# Altium project MiCom.PrjPcb (part 4 of 6)

## Sheet MMC.SchDoc
size A2
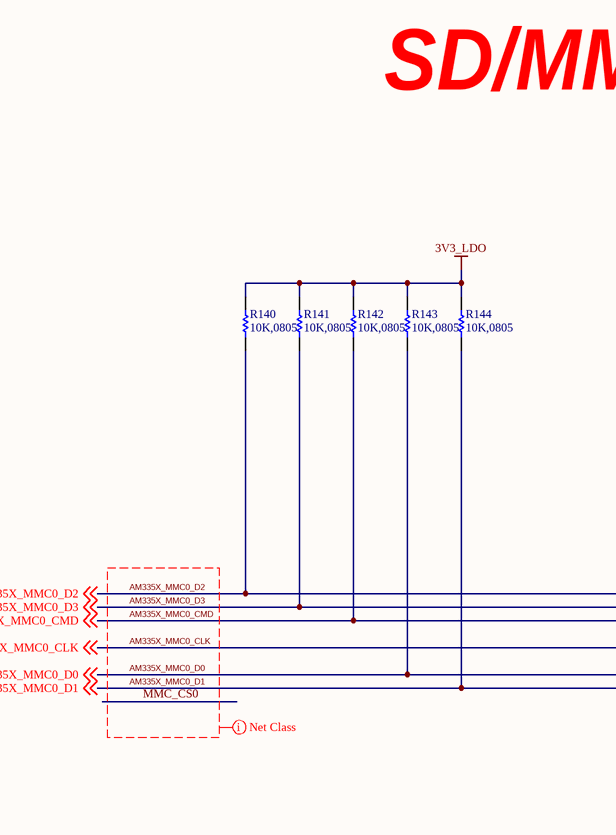
[diagram p14: MMC.SchDoc, left]
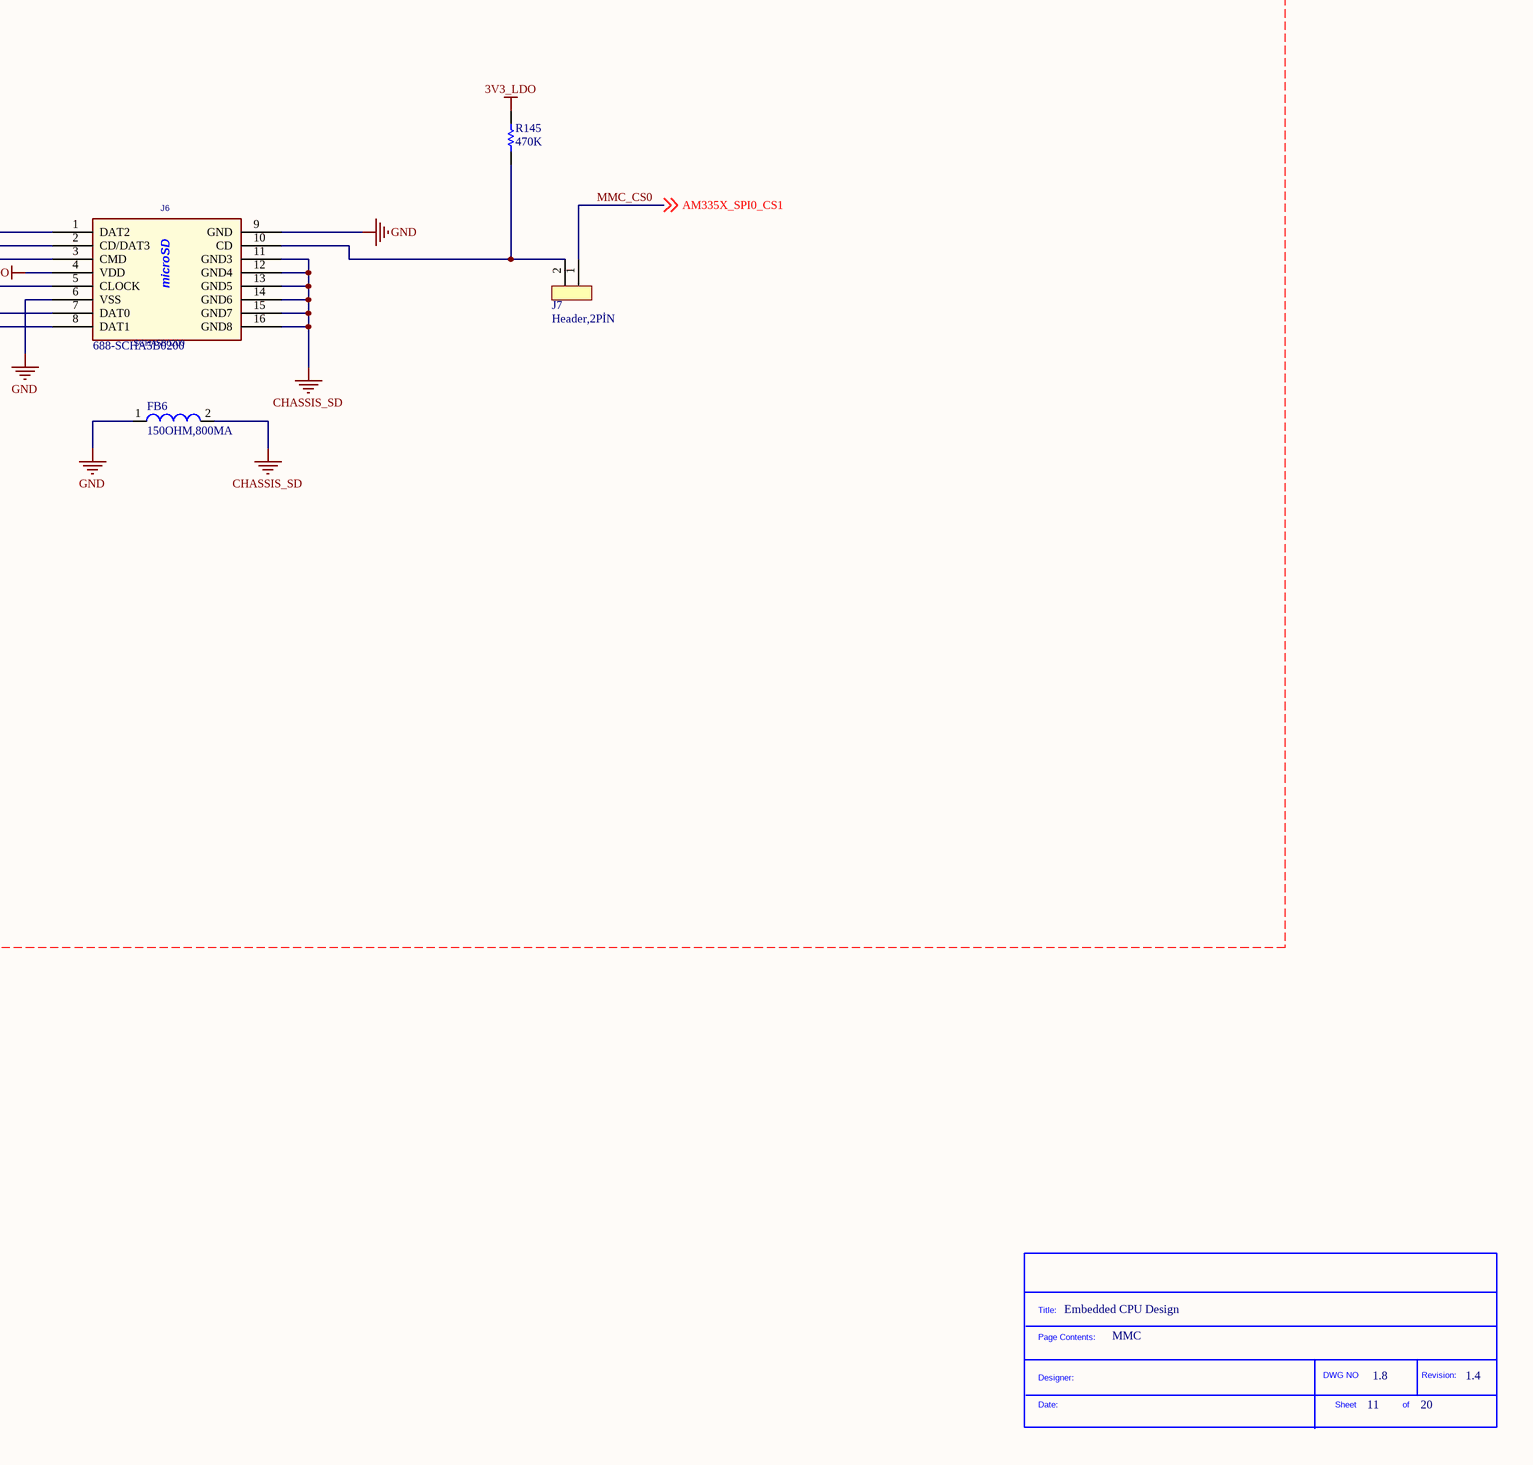
[diagram p15: MMC.SchDoc, right]

### Parts
(Parts that share a designator on the sheet are numbered #1, #2 ... from top to bottom, then left to right.)
*?#8  SDTitleBlock  (value not drawn)  (graphical)
FB6  150OHM,800MA  [0805]
J6  SCHA5B0200  Supplier Part Number 1: 688-SCHA5B0200  [SD-MICRO-SCHA5B0300]
J7  Header,2PİN  [HEADER,2PİN]
R140  10K,0805  [0805]
R141  10K,0805  [0805]
R142  10K,0805  [0805]
R143  10K,0805  [0805]
R144  10K,0805  [0805]
R145  470K  [0805]

### Nets
3V3_LDO: J6.4(VDD) R140.2 R141.2 R142.2 R143.2 R144.2 R145.2
CHASSIS_SD: FB6.2 J6.11(GND3) J6.12(GND4) J6.13(GND5) J6.14(GND6) J6.15(GND7) J6.16(GND8)
GND: FB6.1 J6.6(VSS) J6.9(GND)
AM335X_MMC0_CLK: J6.5(CLOCK) ; off-sheet AM335X_MMC0_CLK
AM335X_MMC0_CMD: J6.3(CMD) R142.1 ; off-sheet AM335X_MMC0_CMD
AM335X_MMC0_D0: J6.7(DAT0) R143.1 ; off-sheet AM335X_MMC0_D0
AM335X_MMC0_D1: J6.8(DAT1) R144.1 ; off-sheet AM335X_MMC0_D1
AM335X_MMC0_D2: J6.1(DAT2) R140.1 ; off-sheet AM335X_MMC0_D2
AM335X_MMC0_D3: J6.2(CD/DAT3) R141.1 ; off-sheet AM335X_MMC0_D3
MMC_CS0: J7.1 ; off-sheet AM335X_SPI0_CS1  [also labelled AM335X_SPI0_CS1]
NetJ6_10: J6.10(CD) J7.2 R145.1

### Layout directives
net class MMC: AM335X_MMC0_CLK, AM335X_MMC0_CMD, AM335X_MMC0_D0, AM335X_MMC0_D1, AM335X_MMC0_D2, AM335X_MMC0_D3, MMC_CS0
net class MMC_P: 3V3_LDO, AM335X_MMC0_CLK, AM335X_MMC0_CMD, AM335X_MMC0_D0, AM335X_MMC0_D1, AM335X_MMC0_D2, AM335X_MMC0_D3, AM335X_SPI0_CS1, CHASSIS_SD, GND, MMC_CS0

### Notes on the sheet
- SD/MMC Connector
- Embedded CPU Design
- MMC
- 11
- 1.8
- 20
- 1.4
- (in symbol SDTitleBlock) Title:; Page Contents:; DWG NO; Revision:; Designer:; Date:; Sheet; of

### Library data of the parts
FB6 = 150OHM,800MA: FERRITE 800MA 150 OHM 0805 SMD; Manufacturer: Laird-Signal Integrity Products; Manufacturer Part Number: LI0805H151R-10; Impedance @ Frequency: 150 Ohm @ 100MHz; DC Resistance (DCR): 150 mOhm Max; Filter Type: Differential Mode - Single; Supplier 1: Digi-Key; RoHS: RoHS Compliant; Category: Filters; Stock 1: 418596; Pricing 1: 1=0.1, 10=0.07, 25=0.064, 50=0.0574, 100=0.0421, 250=0.03064, 500=0.02808, 1000=0.02424 (USD); Packaging: Cut Tape (CT); Current Rating: 800mA; Package / Case: 0805 (2012 Metric); Mounting Type: Surface Mount; Height (Max): 0.043" (1.10mm); Size / Dimension: 0.079" L x 0.049" W (2.00mm x 1.25mm); ComponentLink1URL: http://www.lairdtech.com/WorkArea/linkit.aspx?LinkIdentifier=id&ItemID=4912; ComponentLink1Description: http://www.lairdtech.com/WorkArea/linkit.aspx?LinkIdentifier=id&ItemID=4912; Supplier Part Number 1: 240-2384-1-ND
J6 = Conn_microSD_8: TIIntPartnumber: 2C0102; Mfr: ALPS; PartName: Conn_microSD_SCHA5B0200; DescriptiveText: Connector compact low-profile Push Type Micro SD; Cost10K: x.00; Vendor: Mouser; Number of Contacts: 8; Voltage Rating: 500 VAC; Insertion - Extraction Style: Push-Push; Mating Cycles: 10 k; Cost100: x.00; MfrNum: SCHA5B0200; Supplier 1: Mouser; Manufacturer: ALPS; Manufacturer Part Number: SCHA5B0200; RoHS: RoHS Compliant; Category: Memory Card Connectors; Features: With switch; Height: 15.25 mm; Length: 13.825 mm; Mounting Type: Reverse; Number of Rows: 1; Orientation: Horizontal; Packaging: Reel; Product: Card Connectors; Termination Style: SMD; Brand: ALPS; Mounting Style: -; Card Type: microSD; Standard Pack Qty: 1500; RoHS - Mouser: Y; Minimum Order Quantity: 1; Reeling: True; ComponentLink1URL: http://www.mouser.com/ds/2/15/SCHA-186221.pdf; ComponentLink1Description: http://www.mouser.com/ds/2/15/SCHA-186221.pdf; Stock 1: 13412; Pricing 1: 1=1.62, 25=1.46, 50=1.35, 100=1.31, 500=1.22, 1000=1.18, 1500=1.14, 4500=1.07, 9000=1.04 (AUD)
R140-R144 = 10K,0805: BOURNS - CR0805-FX-1002GLF - RESISTOR, 10K, 0.125W, 1%; Product Range: BOURNS - CR Series; Resistance: 10; Power Rating: 125; Resistor Case Style: 0805 [2012 Metric]; Resistor Element Material: Thick Film; Temperature Coefficient: ± 100; Voltage Rating: 150; SVHC: No SVHC (16-Jun-2014); Resistor Mounting: SMD<!--FANDB--><div class="features-and-benefits-container"></div>; Power (Watts): 0.125W, 1/8W; Supplier 1: Digi-Key; Manufacturer: BOURNS; Manufacturer Part Number: CR0805-FX-1002GLF; RoHS: YES; Stock 1: 1116166; Pricing 1: 1=0.1, 10=0.029, 50=0.0162, 100=0.0123, 250=0.00912, 500=0.00672, 1000=0.00448, 2500=0.00378 (USD); Resistance Tolerance: ± 1%; Packaging: Cut Tape; MSL: MSL 1 - Unlimited; ComponentLink1URL: http://www.farnell.com/datasheets/1845293.pdf; ComponentLink1Description: http://www.farnell.com/datasheets/1845293.pdf; Supplier Part Number 1: RMCF0805FT10K0CT-ND; Category: Resistors; Resistance (Ohms): 10k; Tolerance: ±1%; Composition: Thick Film; Features: -; Operating Temperature: -55°C ~ 155°C; Package / Case: 0805 (2012 Metric); Supplier Device Package: 0805; Size / Dimension: 0.079" L x 0.049" W (2.00mm x 1.25mm); Height: 0.026" (0.65mm); Number of Terminations: 2; ComponentLink2URL: http://www.seielect.com/Catalog/SEI-RMCF_RMCP.pdf; ComponentLink2Description: http://www.seielect.com/Catalog/SEI-RMCF_RMCP.pdf
R145 = 470K: RES 470K OHM 1/8W 1% 0805 SMD; Manufacturer: Rohm Semiconductor; Manufacturer Part Number: MCR10ERTF4703; Power (Watts): 0.125W, 1/8W; Temperature Coefficient: ±100ppm/°C; Supplier 1: Digi-Key; RoHS: RoHS Compliant; Category: Resistors; Stock 1: 10000; Pricing 1: 5000=0.00319, 10000=0.00277, 25000=0.00244, 50000=0.00223, 125000=0.00219 (USD); Packaging: Tape & Reel (TR); Resistance (Ohms): 470k; Tolerance: ±1%; Composition: Thick Film; Features: -; Package / Case: 0805 (2012 Metric); Supplier Device Package: 0805 (2012 Metric); Size / Dimension: 0.079" L x 0.049" W (2.00mm x 1.25mm); Height: 0.024" (0.60mm); Number of Terminations: 2; ComponentLink1URL: http://rohmfs.rohm.com/en/products/databook/datasheet/passive/resistor/chip_resistor/mcr_g.pdf; ComponentLink1Description: http://rohmfs.rohm.com/en/products/databook/datasheet/passive/resistor/chip_resistor/mcr_g.pdf; Supplier Part Number 1: RHM470KCHTR-ND

## Sheet NAND_MEMORY.SchDoc
size A2
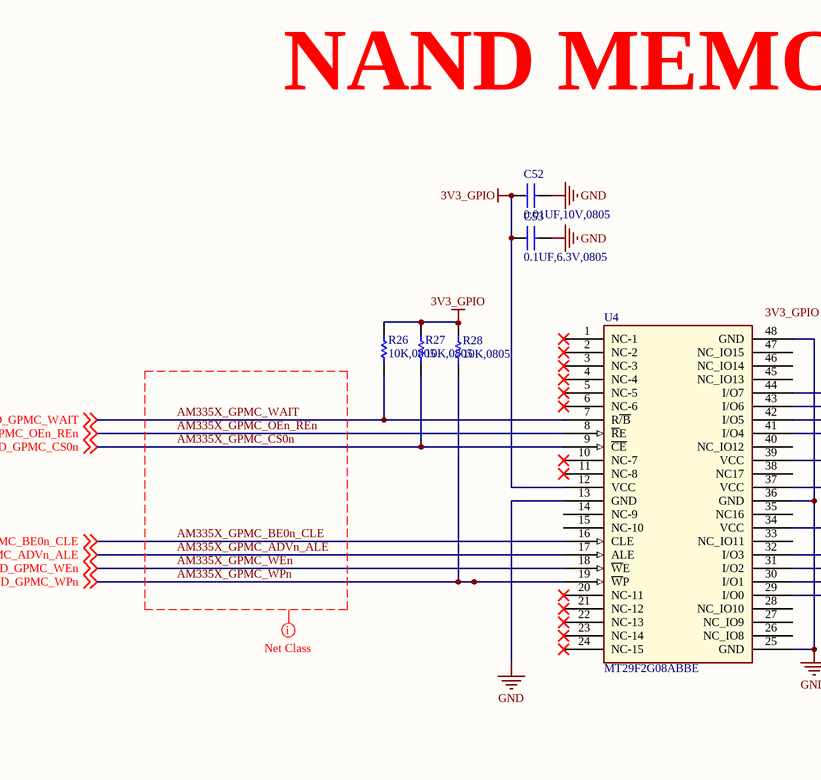
[diagram p16: NAND_MEMORY.SchDoc, left]
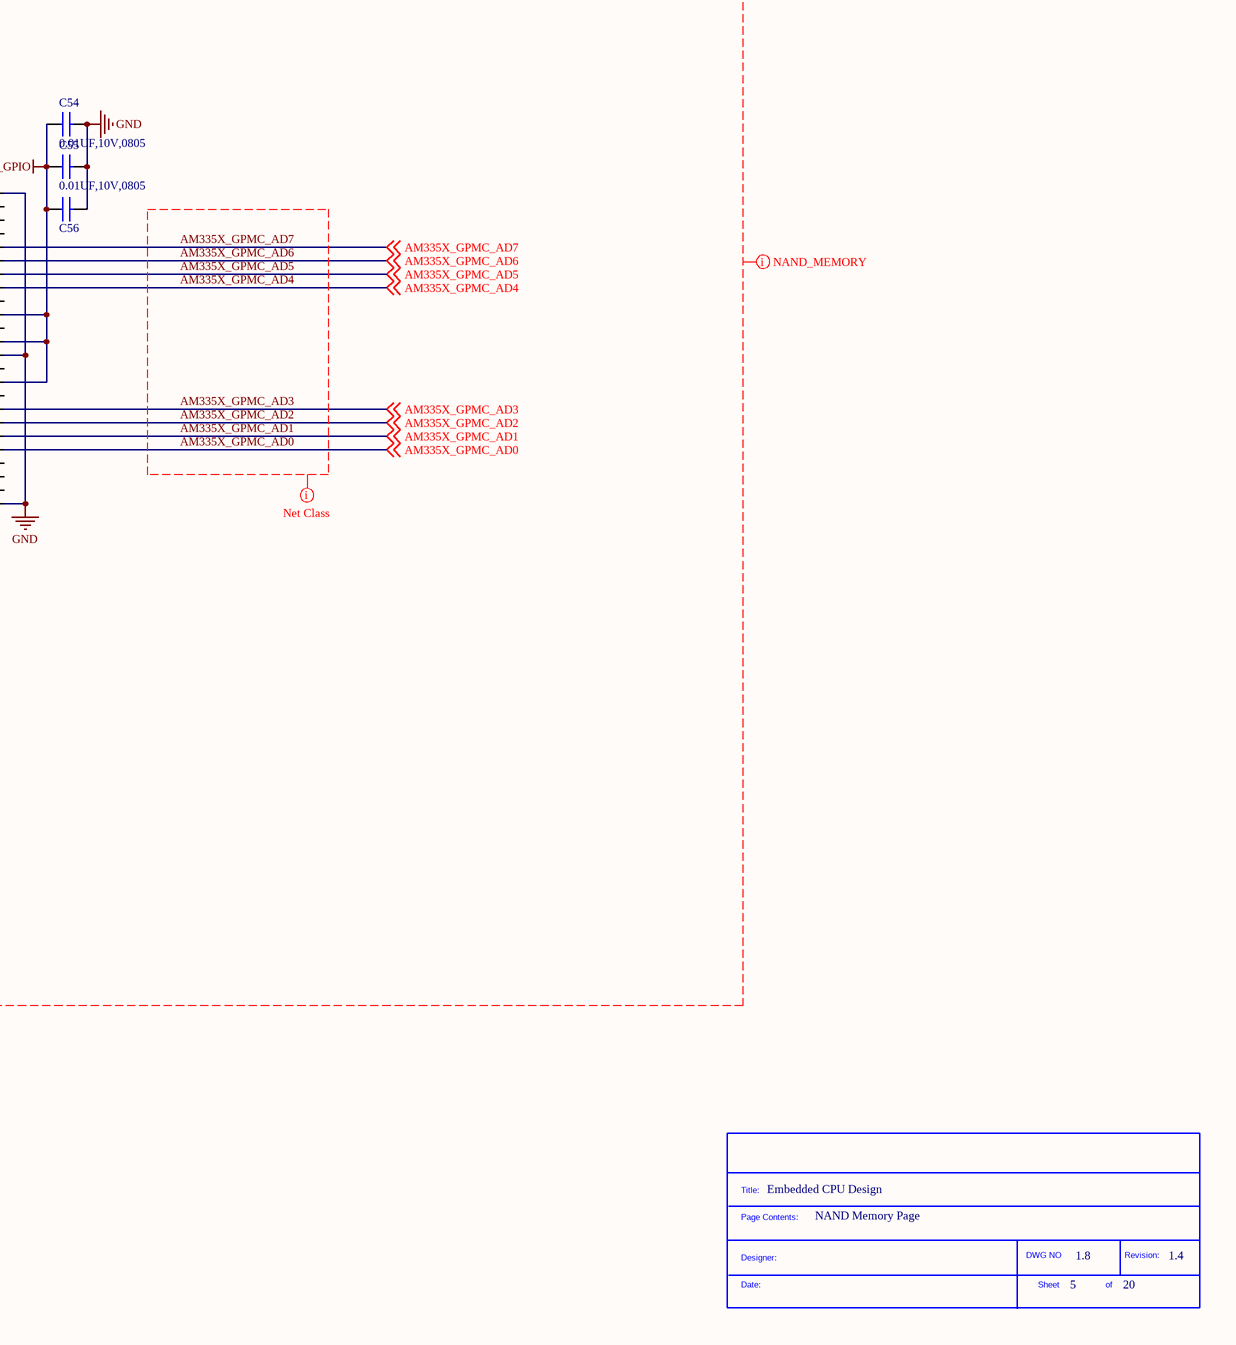
[diagram p17: NAND_MEMORY.SchDoc, right]

### Parts
(Parts that share a designator on the sheet are numbered #1, #2 ... from top to bottom, then left to right.)
*?#9  SDTitleBlock  (value not drawn)  (graphical)
C52  0.01UF,10V,0805  [0402]
C53  0.1UF,6.3V,0805  [0402]
C54  0.01UF,10V,0805  [0402]
C55  0.01UF,10V,0805  [0402]
C56  0.01UF,10V,0805  [0402]  (value not drawn)
R26  10K,0805  [0402]
R27  10K,0805  [0402]
R28  10K,0805  [0402]
U4  MT29F2G08ABBE  [skt-tsop48sm]

### Nets
3V3_GPIO: C52.1 C53.1 C54.1 C55.1 C56.1 R26.2 R27.2 R28.2 U4.12(VCC) U4.34(VCC) U4.37(VCC) U4.39(VCC)  [project net AM335X_VDDSHV1]
GND: C52.2 C53.2 C54.2 C55.2 C56.2 U4.13(GND) U4.25(GND) U4.36(GND) U4.48(GND)
AM335X_GPMC_AD0: U4.29(I/O0) ; off-sheet AM335X_GPMC_AD0
AM335X_GPMC_AD1: U4.30(I/O1) ; off-sheet AM335X_GPMC_AD1
AM335X_GPMC_AD2: U4.31(I/O2) ; off-sheet AM335X_GPMC_AD2
AM335X_GPMC_AD3: U4.32(I/O3) ; off-sheet AM335X_GPMC_AD3
AM335X_GPMC_AD4: U4.41(I/O4) ; off-sheet AM335X_GPMC_AD4
AM335X_GPMC_AD5: U4.42(I/O5) ; off-sheet AM335X_GPMC_AD5
AM335X_GPMC_AD6: U4.43(I/O6) ; off-sheet AM335X_GPMC_AD6
AM335X_GPMC_AD7: U4.44(I/O7) ; off-sheet AM335X_GPMC_AD7
AM335X_GPMC_ADVn_ALE: U4.17(ALE) ; off-sheet NAND_GPMC_ADVn_ALE  [also labelled NAND_GPMC_ADVn_ALE]
AM335X_GPMC_BE0n_CLE: U4.16(CLE) ; off-sheet NAND_GPMC_BE0n_CLE  [also labelled NAND_GPMC_BE0n_CLE]
AM335X_GPMC_CS0n: R27.1 U4.9(~{CE}) ; off-sheet NAND_GPMC_CS0n  [also labelled NAND_GPMC_CS0n]
AM335X_GPMC_OEn_REn: U4.8(~{R}E) ; off-sheet NAND_GPMC_OEn_REn  [also labelled NAND_GPMC_OEn_REn]
AM335X_GPMC_WAIT: R26.1 U4.7(R~{/B}) ; off-sheet NAND_GPMC_WAIT  [also labelled NAND_GPMC_WAIT]
AM335X_GPMC_WEn: U4.18(~{W}E) ; off-sheet NAND_GPMC_WEn  [also labelled NAND_GPMC_WEn]
AM335X_GPMC_WPn: R28.1 U4.19(~{W}P) ; off-sheet NAND_GPMC_WPn  [also labelled NAND_GPMC_WPn]

Not connected (* = marked no-connect by the designer): U4 1(NC-1)* 2(NC-2)* 3(NC-3)* 4(NC-4)* 5(NC-5)* 6(NC-6)* 10(NC-7)* 11(NC-8)* 14(NC-9) 15(NC-10) 20(NC-11)* 21(NC-12)* 22(NC-13)* 23(NC-14)* 24(NC-15)* 26(NC_IO8) 27(NC_IO9) 28(NC_IO10) 33(NC_IO11) 35(NC16) 38(NC17) 40(NC_IO12) 45(NC_IO13) 46(NC_IO14) 47(NC_IO15)

### Layout directives
net class NAND: AM335X_GPMC_ADVn_ALE, AM335X_GPMC_BE0n_CLE, AM335X_GPMC_CS0n, AM335X_GPMC_OEn_REn, AM335X_GPMC_WAIT, AM335X_GPMC_WEn, AM335X_GPMC_WPn
net class NAND_GPMC: AM335X_GPMC_AD0, AM335X_GPMC_AD1, AM335X_GPMC_AD2, AM335X_GPMC_AD3, AM335X_GPMC_AD4, AM335X_GPMC_AD5, AM335X_GPMC_AD6, AM335X_GPMC_AD7
net class NAND_MEMORY: 3V3_GPIO, AM335X_GPMC_AD0, AM335X_GPMC_AD1, AM335X_GPMC_AD2, AM335X_GPMC_AD3, AM335X_GPMC_AD4, AM335X_GPMC_AD5, AM335X_GPMC_AD6, AM335X_GPMC_AD7, AM335X_GPMC_ADVn_ALE, AM335X_GPMC_BE0n_CLE, AM335X_GPMC_CS0n, AM335X_GPMC_OEn_REn, AM335X_GPMC_WAIT, AM335X_GPMC_WEn, AM335X_GPMC_WPn, GND, NAND_GPMC_ADVn_ALE, NAND_GPMC_BE0n_CLE, NAND_GPMC_CS0n, NAND_GPMC_OEn_REn, NAND_GPMC_WAIT, NAND_GPMC_WEn, NAND_GPMC_WPn

### Notes on the sheet
- NAND MEMORY
- Embedded CPU Design
- NAND Memory Page
- 5
- 1.8
- 20
- 1.4
- (in symbol SDTitleBlock) Title:; Page Contents:; Designer:; DWG NO; Revision:; Date:; Sheet; of

### Library data of the parts
C52 C54-C56 = 0.01UF,10V,0805: MULTICOMP - MCSH21B103K100CT - CAP, MLCC, X7R, 10NF, 10V, 0805; Capacitance: 10000pF; Tolerance: ±10%; Voltage - Rated: 16V; Supplier 1: Digi-Key; Manufacturer: MULTICOMP; Manufacturer Part Number: MCSH21B103K100CT; RoHS: YES; Stock 1: 21284; Pricing 1: 1=0.24, 10=0.2, 50=0.1126, 100=0.1, 250=0.075, 500=0.06626, 1000=0.05875 (USD); ComponentLink1URL: http://www.farnell.com/datasheets/1825494.pdf; ComponentLink1Description: http://www.farnell.com/datasheets/1825494.pdf; Supplier Part Number 1: 399-7995-1-ND; Category: Capacitors; Packaging: Cut Tape (CT); Temperature Coefficient: X7R; Mounting Type: Surface Mount, MLCC; Operating Temperature: -55°C ~ 125°C; Applications: General Purpose; Ratings: -; Package / Case: 0805 (2012 Metric); Size / Dimension: 0.079" L x 0.049" W (2.00mm x 1.25mm); Height - Seated (Max): -; Thickness (Max): 0.035" (0.88mm); Lead Spacing: -; Features: -; Lead Style: -; ComponentLink2URL: http://www.kemet.com/docfinder?Partnumber=C0805C103K4RACTU; ComponentLink2Description: http://www.kemet.com/docfinder?Partnumber=C0805C103K4RACTU
C53 = 0.1UF,6.3V,0805: as C44-C46 on sheet DDR_3; Supplier 1: Digi-Key; RoHS: RoHS Compliant; Category: Capacitors; Stock 1: 19204; Pricing 1: 1=0.12, 10=0.083, 25=0.062, 50=0.0476, 100=0.0392, 250=0.03304, 1000=0.02228 (USD); Packaging: Digi-Reel®; Tolerance: ±10%; Voltage - Rated: 6.3V; Temperature Coefficient: X7R; Mounting Type: Surface Mount, MLCC; Operating Temperature: -55°C ~ 125°C; Applications: General Purpose; Ratings: -; Package / Case: 0805 (2012 Metric); Size / Dimension: 0.079" L x 0.049" W (2.00mm x 1.25mm); Height - Seated (Max): -; Thickness (Max): 0.035" (0.88mm); Lead Spacing: -; Features: -; Lead Style: -; ComponentLink1URL: http://www.kemet.com/docfinder?Partnumber=C0805C104K9RACTU; ComponentLink1Description: http://www.kemet.com/docfinder?Partnumber=C0805C104K9RACTU; Supplier Part Number 1: 399-9155-6-ND
R26-R28 = 10K,0805: as R140 on sheet MMC; Supplier 1: Digi-Key; Manufacturer: BOURNS; Manufacturer Part Number: CR0805-FX-1002GLF; RoHS: YES; Stock 1: 1116166; Pricing 1: 1=0.1, 10=0.029, 50=0.0162, 100=0.0123, 250=0.00912, 500=0.00672, 1000=0.00448, 2500=0.00378 (USD); Resistance Tolerance: ± 1%; Packaging: Cut Tape; MSL: MSL 1 - Unlimited; ComponentLink1URL: http://www.farnell.com/datasheets/1845293.pdf; ComponentLink1Description: http://www.farnell.com/datasheets/1845293.pdf; Supplier Part Number 1: RMCF0805FT10K0CT-ND; Category: Resistors; Resistance (Ohms): 10k; Tolerance: ±1%; Composition: Thick Film; Features: -; Operating Temperature: -55°C ~ 155°C; Package / Case: 0805 (2012 Metric); Supplier Device Package: 0805; Size / Dimension: 0.079" L x 0.049" W (2.00mm x 1.25mm); Height: 0.026" (0.65mm); Number of Terminations: 2; ComponentLink2URL: http://www.seielect.com/Catalog/SEI-RMCF_RMCP.pdf; ComponentLink2Description: http://www.seielect.com/Catalog/SEI-RMCF_RMCP.pdf
U4 = MT29F2G08ABBE: NAND 2Gb Flash Memory x08 width 3.3V; TIIntPartnumber: 1A0255; MfrNum: MT29F2G08ABAEAWP; Mfr: Micron; Cost10K: 3.12; Cost100: 7.1; Vendor: Arrow; DescriptiveText: NAND 2Gb Flash Memory x08 width 3.3V; PartName: MT29F2G08AB; Descriptive_Text: NAND 2Gb Flash Memory x08 width 3.3V; Supplier 1: Digi-Key; Supplier Part Number 1: 557-1487-1-ND

## Sheet POWER_CON.SchDoc
size A4
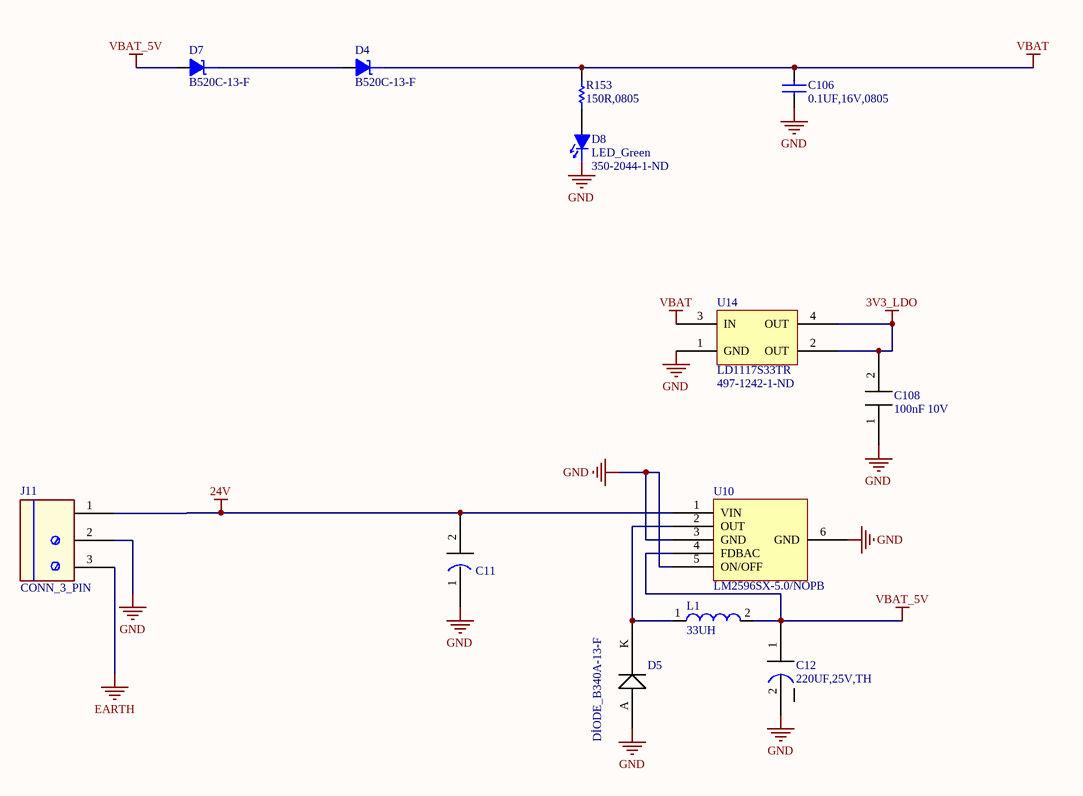
[diagram p18: POWER_CON.SchDoc]

### Parts
C11  EKZE500ELL681MK30S  [HEADER,2PİN]  (value not drawn)
C12  220UF,25V,TH  [TH]
C106  0.1UF,16V,0805  [0805]
C108  100nF 10V  [0805]
D4  B520C-13-F  [B520C-13-F]
D5  DİODE_B340A-13-F  [Diode]
D7  B520C-13-F  [B520C-13-F]
D8  LED_Green  Supplier Part Number 1: 350-2044-1-ND  [LED_0805]
J11  CONN_3_PIN  [CON_3]
L1  33UH  [indkrt_2]
R153  150R,0805  [0805]
U10  LM2596SX-5.0/NOPB  [TO-263-5]
U14  LD1117S33TR  Supplier Part Number 1: 497-1242-1-ND  [SOT-223_L]

### Nets
3V3_LDO: C108.2 U14.2(OUT) U14.4(OUT)
24V: C11.2 J11.1 U10.1(VIN)
EARTH: J11.3
GND: C11.1 C12.2 C106.1 C108.1 D5.A D8.1(Cathode) J11.2 U10.3(GND) U10.5(ON/OFF) U10.6(GND) U14.1(GND)
VBAT: C106.2 D4.1(CATHODE) R153.2 U14.3(IN)
VBAT_5V: C12.1 D7.2(ANODE) L1.2 U10.4(FDBAC)
NetD4_2: D4.2(ANODE) D7.1(CATHODE)
NetD5_K: D5.K L1.1 U10.2(OUT)
NetD8_2: D8.2(Anode) R153.1

### Library data of the parts
C11 = EKZE500ELL681MK30S: Aluminium Electrolytic Capacitors - Leaded 50volts 680uF 12.5X30; Manufacturer: United Chemi-Con; Tolerance: 20 %; Voltage Rating DC: 50 V; Case Diameter: 12.5 mm; Case Length: 30 mm; Supplier 1: Mouser; Manufacturer Part Number: EKZE500ELL681MK30S; RoHS: RoHS Compliant; Category: Aluminium Electrolytic Capacitors - Leaded; Stock 1: 2082; Pricing 1: 1=1.12, 10=0.886, 100=0.591, 500=0.502, 1000=0.443, 2000=0.413, 5000=0.398, 10000=0.384, 25000=0.374 (USD); Capacitance: 680 uF; Dimensions: 12.5 mm Dia. x 30 mm L; Packaging: Bulk; Product: Low Impedance Electrolytic Capacitors; Series: KZE; Termination Style: Radial; Brand: United Chemi-Con; Lead Spacing: 5 mm; Maximum Operating Temperature: + 105 C; Product Category: Aluminum Electrolytic Capacitors; Standard Pack Qty: 1000; RoHS - Mouser: Y; Minimum Order Quantity: 1; Reeling: False; ComponentLink1URL: http://www.mouser.com/ds/2/420/al-kze-e-140701-514740.pdf; ComponentLink1Description: http://www.mouser.com/ds/2/420/al-kze-e-140701-514740.pdf; Supplier Part Number 1: 661-EKZE500ELL681MK3
C12 = 220UF,25V,TH: Manufacturer: Panasonic; Manufacturer Part Number: EEU-FC1E221B; Tolerance: 20 %; Type: Radial Lead Type; ESR: 117 mOhms; Case Diameter: 8 mm; Case Length: 11 mm; Load Life: 2000 h; Ripple Current: 555 mA; Supplier 1: Mouser; RoHS: RoHS Compliant; Category: Aluminium Electrolytic Capacitors - Leaded; Stock 1: 1648; Pricing 1: 1=0.471, 10=0.231, 100=0.149, 1000=0.126, 2000=0.112, 10000=0.102, 25000=0.099, 50000=0.097 (USD); Capacitance: 220 uF; Dimensions: 8 mm Dia. x 11 mm L; Packaging: Ammo Pack; Product: High Temp Electrolytic Capacitors; Series: FC; Termination Style: Radial; Voltage Rating DC: 25 V; Brand: Panasonic; Lead Spacing: 5 mm; Maximum Operating Temperature: + 105 C; Standard Pack Qty: 1000; RoHS - Mouser: Y; Minimum Order Quantity: 1; Reeling: False; ComponentLink1URL: http://www.mouser.com/ds/2/315/ABA0000CE22-68457.pdf; ComponentLink1Description: http://www.mouser.com/ds/2/315/ABA0000CE22-68457.pdf; Supplier Part Number 1: 667-EEU-FC1E221B
C106 = 0.1UF,16V,0805: AVX - 0805YC104KAT2A - CAP, MLCC, X7R, 100NF, 16V, 0805; Capacitance: 0.1; Capacitance Tolerance: ± 10%; Dielectric Characteristic: X7; Voltage Rating: 16; Ceramic Capacitor Case: 0805 [2012 Metric]; SVHC: No SVHC (16-Jun-2014); Capacitor Case Style: 0805 [2012 Metric]<!--FANDB--><div class="features-and-benefits-container"></div>; Tolerance: ±10%; Supplier 1: Digi-Key; Manufacturer: AVX; Manufacturer Part Number: 0805YC104KAT2A; RoHS: YES; Stock 1: 9101; Pricing 1: 1=0.29, 10=0.198, 100=0.1008, 250=0.0816, 500=0.072, 1000=0.0612 (USD); Product Range: -; Operating Temperature Min: -55; Operating Temperature Max: 125; Packaging: Cut Tape; MSL: MSL 1 - Unlimited; Capacitance Tolerance ±: ± 10%; ComponentLink1URL: http://www.farnell.com/datasheets/1679506.pdf; ComponentLink1Description: http://www.farnell.com/datasheets/1679506.pdf; Supplier Part Number 1: 478-7961-1-ND; Category: Capacitors; Voltage - Rated: 16V; Temperature Coefficient: X7R; Mounting Type: Surface Mount, MLCC; Operating Temperature: -55°C ~ 125°C; Applications: General Purpose; Ratings: -; Package / Case: 0805 (2012 Metric); Size / Dimension: 0.079" L x 0.049" W (2.00mm x 1.25mm); Height - Seated (Max): -; Thickness (Max): 0.037" (0.94mm); Lead Spacing: -; Features: -; Lead Style: -; ComponentLink2URL: http://www.avx.com/docs/Catalogs/cx7r.pdf; ComponentLink2Description: http://www.avx.com/docs/Catalogs/cx7r.pdf
C108 = 100nF 10V 8055C104JAT2A: AVX - 08055C104JAT2A - CAP, MLCC, X7R, 100NF, 50V, 0805; Capacitance: 0.1; Capacitance Tolerance: ± 5%; Dielectric Characteristic: X7; Voltage Rating: 50; Ceramic Capacitor Case: 0805 [2012 Metric]; SVHC: No SVHC (16-Jun-2014); Capacitor Terminals: SMD; External Depth: 1.25; External Length / Height: 0.5; External Width: 2.01; No. of Pins: 2; No. of Channels: 4; Isolation Voltage: 2.5; CTR Min: 50%; Forward Current If Max: 30; Optocoupler Case Style: SSOP; Input Current: 5; Optocoupler Output Type: Phototransistor; Output Voltage: 80; Tolerance: ±5%; Supplier 1: Digi-Key; Manufacturer: AVX; Manufacturer Part Number: 08055C104JAT2A; RoHS: YES; Stock 1: 205492; Pricing 1: 1=0.15, 10=0.1, 100=0.0475, 250=0.04, 500=0.0335, 1000=0.0275 (USD); Product Range: -; Operating Temperature Min: -55; Operating Temperature Max: 125; Packaging: Cut Tape; MSL: MSL 1 - Unlimited; Capacitance Tolerance ±: ± 5%; Capacitor Case Style: 0805 [2012 Metric]; Operating Temperature Range: -55°C to +125; Series: MLCC<!--FANDB--><div class="features-and-benefits-container"></div>; ComponentLink1URL: http://www.farnell.com/datasheets/1679506.pdf; ComponentLink1Description: http://www.farnell.com/datasheets/1679506.pdf; ComponentLink2URL: http://www.farnell.com/cad/1614383.zip; ComponentLink2Description: http://www.farnell.com/cad/1614383.zip; Supplier Part Number 1: 478-3352-1-ND; ComponentLink3URL: http://www.farnell.com/datasheets/1825494.pdf; ComponentLink3Description: http://www.farnell.com/datasheets/1825494.pdf; ComponentLink4URL: http://www.farnell.com/datasheets/89583.pdf; ComponentLink4Description: http://www.farnell.com/datasheets/89583.pdf; Category: Capacitors; Voltage - Rated: 50V; Temperature Coefficient: X7R; Mounting Type: Surface Mount, MLCC; Operating Temperature: -55°C ~ 125°C; Applications: General Purpose; Ratings: -; Package / Case: 0805 (2012 Metric); Size / Dimension: 0.079" L x 0.049" W (2.01mm x 1.25mm); Height - Seated (Max): -; Thickness (Max): 0.037" (0.94mm); Lead Spacing: -; Features: -; Lead Style: -; ComponentLink5URL: http://www.avx.com/docs/Catalogs/cx7r.pdf; ComponentLink5Description: http://www.avx.com/docs/Catalogs/cx7r.pdf
D4 D7 = Diode_5ARect: Diode Power Rectifier 5A Schottky; Mfr: Diodes Inc; TIIntPartnumber: 1E0012; Vendor: Digikey; Cost100: 0.17; Cost10K: 0.09; DescriptiveText: Diode Power Rectifier 5A Schottky; PartName: Diode_5ARect; MfrNum: B520C-13-F; Descriptive_Text: Diode Power Rectifier 5A Schottky; Supplier 1: Digi-Key; Supplier Part Number 1: B520C-FDITR-ND
D5 = DİODE_B340A-13-F: MULTICOMP - B340A-13-F - DIODE, RECTIFIER, 3A, 40V, DO-214AC; Supplier 1: Farnell; Manufacturer: MULTICOMP; Manufacturer Part Number: B340A-13-F; RoHS: YES; Stock 1: 9862; Pricing 1: 1=0,28, 10=0,166, 50=0,125, 100=0,117, 500=0,109, 1000=0,101 (EUR); ComponentLink1URL: http://www.farnell.com/datasheets/1693726.pdf; ComponentLink1Description: http://www.farnell.com/datasheets/1693726.pdf; Supplier Part Number 1: 2306401
D8 = LED_Green: LED Green SMD 20mA 2V 0805; TIIntPartnumber: 1F0008; MfrNum: 598-8170-107F; Mfr: Dialight; PartName: LEDGreen2x1.5; Cost10K: 0.052; Cost100: 0.081; Vendor: Digikey; Wavelength - Dominant: 566nm; Millicandela Rating: 20mcd; Viewing Angle: 140°; Lens Type: Clear; Lens Style/Size: Rectangle with Flat Top, 1.4mm x 1.25mm; DescriptiveText: LED Green SMD 20mA 2V 0805; Descriptive_Text: LED Green SMD 20mA 2V 0805; Supplier 1: Digi-Key; Manufacturer: Dialight; Manufacturer Part Number: 598-8170-107F; RoHS: RoHS Compliant; Category: Optoelectronics; Stock 1: 91030; Pricing 1: 1=0.42, 10=0.31, 25=0.248, 100=0.1643, 250=0.1364, 500=0.0992, 1000=0.0775 (USD); Packaging: Cut Tape (CT); Color: Green; Wavelength - Peak: -; Voltage - Forward (Vf) (Typ): 2V; Current - Test: 20mA; Package / Case: 0805 (2012 Metric); Size / Dimension: 2.00mm L x 1.25mm W; Height: 0.70mm; Mounting Type: Surface Mount; Luminous Flux @ Current - Test: -; ComponentLink1URL: http://media.digikey.com/pdf/Data%20Sheets/Dialight%20PDFs/598_Series_0805_Pkg.pdf; ComponentLink1Description: http://media.digikey.com/pdf/Data%20Sheets/Dialight%20PDFs/598_Series_0805_Pkg.pdf
L1 = SRR1260-330M: Fixed Inductors 33uH 20% SMD 1260; Manufacturer: Bourns; Maximum DC Current: 3 A; Maximum DC Resistance: 60 mOhms; Q Minimum: 27; Self Resonant Frequency: 9.97 MHz; Shielding: Shielded; Type: Shielded Power Inductor; Case Height: 6 mm; Case Length: 12.5 mm; Supplier 1: Mouser; Manufacturer Part Number: SRR1260-330M; RoHS: RoHS Compliant; Category: Fixed Inductors; Stock 1: 3279; Pricing 1: 1=0.972, 10=0.853, 50=0.730, 100=0.694, 250=0.634, 600=0.439, 1200=0.437 (USD); Inductance: 33 uH; Operating Temperature Range: - 40 C to + 125 C; Package/Case: 1260; Packaging: Reel; Product: Power Inductors; Series: SRR1260; Termination Style: SMD/SMT; Tolerance: 20 %; Brand: Bourns; Case Width: 12.5 mm; Product Category: Shielded Power Inductors; Standard Pack Qty: 600; RoHS - Mouser: Y; Minimum Order Quantity: 1; Reeling: True; ComponentLink1URL: http://www.mouser.com/ds/2/54/SRR1260-59143.pdf; ComponentLink1Description: http://www.mouser.com/ds/2/54/SRR1260-59143.pdf; Supplier Part Number 1: 652-SRR1260-330M
R153 = 150R,0805: TE CONNECTIVITY / NEOHM - CPF0805B150RE1 - RESISTOR, 0805, 150R; Product Range: TE CONNECTIVITY - CPF Series; Resistance: 150; Power Rating: 100; Resistance Tolerance: ± 0.1%; Resistor Case Style: 0805 [2012 Metric]; Resistor Element Material: Thin Film; Temperature Coefficient: ± 25; Voltage Rating: 200; External Depth: 0.5; External Length / Height: 2; External Width: 1.25; Resistor Mounting: SMD; Tolerance: ±5%; Power (Watts): 0.125W, 1/8W; Supplier 1: Digi-Key; Manufacturer: TE CONNECTIVITY / NEOHM; Manufacturer Part Number: CPF0805B150RE1; RoHS: YES; Stock 1: 143875; Pricing 1: 1=0.1, 10=0.021, 50=0.0116, 100=0.0088, 250=0.00652, 500=0.0048, 1000=0.0032, 2500=0.0027 (USD); Packaging: Cut Tape; MSL: -; No. of Pins: 2; Operating Temperature Max: 155; Operating Temperature Min: -55; Operating Temperature Range: -55°C to +155; Series: CPF<!--FANDB--><div class="features-and-benefits-container"></div>; ComponentLink1URL: http://www.tycoelectronics.com/commerce/DocumentDelivery/DDEController?Action=srchrtrv&DocNm=1614884&DocType=Customer+Drawing&DocLang=English; ComponentLink1Description: http://www.tycoelectronics.com/commerce/DocumentDelivery/DDEController?Action=srchrtrv&DocNm=1614884&DocType=Customer+Drawing&DocLang=English; ComponentLink2URL: http://www.tycoelectronics.com/commerce/DocumentDelivery/DDEController?Action=srchrtrv&DocNm=1773200&DocType=Data+Sheet&DocLang=English; ComponentLink2Description: http://www.tycoelectronics.com/commerce/DocumentDelivery/DDEController?Action=srchrtrv&DocNm=1773200&DocType=Data+Sheet&DocLang=English; Supplier Part Number 1: RMCF0805JT150RCT-ND; Category: Resistors; Resistance (Ohms): 150; Composition: Thick Film; Features: -; Operating Temperature: -55°C ~ 155°C; Package / Case: 0805 (2012 Metric); Supplier Device Package: 0805; Size / Dimension: 0.079" L x 0.049" W (2.00mm x 1.25mm); Height: 0.026" (0.65mm); Number of Terminations: 2; ComponentLink3URL: http://www.seielect.com/Catalog/SEI-RMCF_RMCP.pdf; ComponentLink3Description: http://www.seielect.com/Catalog/SEI-RMCF_RMCP.pdf
U10 = LM2596SX-5.0/NOPB: Voltage Regulators - Switching Regulators 150 KHZ 3A STEP-DOWN VLTG REG; Manufacturer: Texas Instruments; Input Voltage MAX: 40 V; Number of Outputs: 1 Output; Output Voltage: 5 V; Switching Frequency: 173 kHz; Topology: Buck; Input Voltage MIN: 4.5 V; Supplier 1: Mouser; Manufacturer Part Number: LM2596SX-5.0/NOPB; RoHS: RoHS Compliant; Category: Voltage Regulators - Switching Regulators; Stock 1: 1902; Pricing 1: 1=4.45, 10=3.98, 25=3.57, 50=3.42, 100=3.26, 250=2.94, 500=2.64, 1000=2.39, 1500=2.03 (USD); Operating Temperature Range: - 40 C to + 85 C; Output Current: 3 A; Package/Case: TO-263-5; Packaging: Reel; Series: LM2596; Type: Inverting, Step Down; Brand: Texas Instruments; Mounting Style: SMD/SMT; Maximum Operating Temperature: + 125 C; Minimum Operating Temperature: - 40 C; Standard Pack Qty: 500; RoHS - Mouser: Y; Minimum Order Quantity: 1; Reeling: True; ComponentLink1URL: http://www.mouser.com/ds/2/405/snvs124c-317006.pdf; ComponentLink1Description: http://www.mouser.com/ds/2/405/snvs124c-317006.pdf; Supplier Part Number 1: 926-LM2596SX-5.0NOPB
U14 = LD1117S33TR: STMICROELECTRONICS - LD1117S33TR - IC, LDO VOLT REG, 3.3V, 0.8A, SOT-223-3; Regulator Topology: Positive Fixed; Current - Output: 800mA; Voltage - Dropout (Typical): 1.1V @ 800mA; Number of Regulators: 1; Voltage - Input: Up to 15V; Supplier 1: Digi-Key; Manufacturer: STMICROELECTRONICS; Manufacturer Part Number: LD1117S33TR; RoHS: YES; Stock 1: 36493; Pricing 1: 1=0.55, 10=0.434, 25=0.366, 100=0.2983, 250=0.24704, 500=0.20408, 1000=0.14985 (USD); ComponentLink1URL: http://www.st.com/internet/com/TECHNICAL_RESOURCES/TECHNICAL_LITERATURE/PACKING_INFORMATION/CD00148931.pdf; ComponentLink1Description: http://www.st.com/internet/com/TECHNICAL_RESOURCES/TECHNICAL_LITERATURE/PACKING_INFORMATION/CD00148931.pdf; ComponentLink2URL: http://www.farnell.com/datasheets/1776449.pdf; ComponentLink2Description: http://www.farnell.com/datasheets/1776449.pdf; ComponentLink3URL: http://www.farnell.com/cad/1724370.zip; ComponentLink3Description: http://www.farnell.com/cad/1724370.zip; Category: Integrated Circuits (ICs); Packaging: Cut Tape (CT); Voltage - Output: 3.3V; Current - Limit (Min): -; Operating Temperature: 0°C ~ 125°C; Mounting Type: Surface Mount; Package / Case: TO-261-4, TO-261AA; Supplier Device Package: SOT-223; ComponentLink4URL: http://www.st.com/web/en/resource/technical/document/datasheet/CD00000544.pdf; ComponentLink4Description: http://www.st.com/web/en/resource/technical/document/datasheet/CD00000544.pdf

## Sheet RS232.SchDoc
size A4
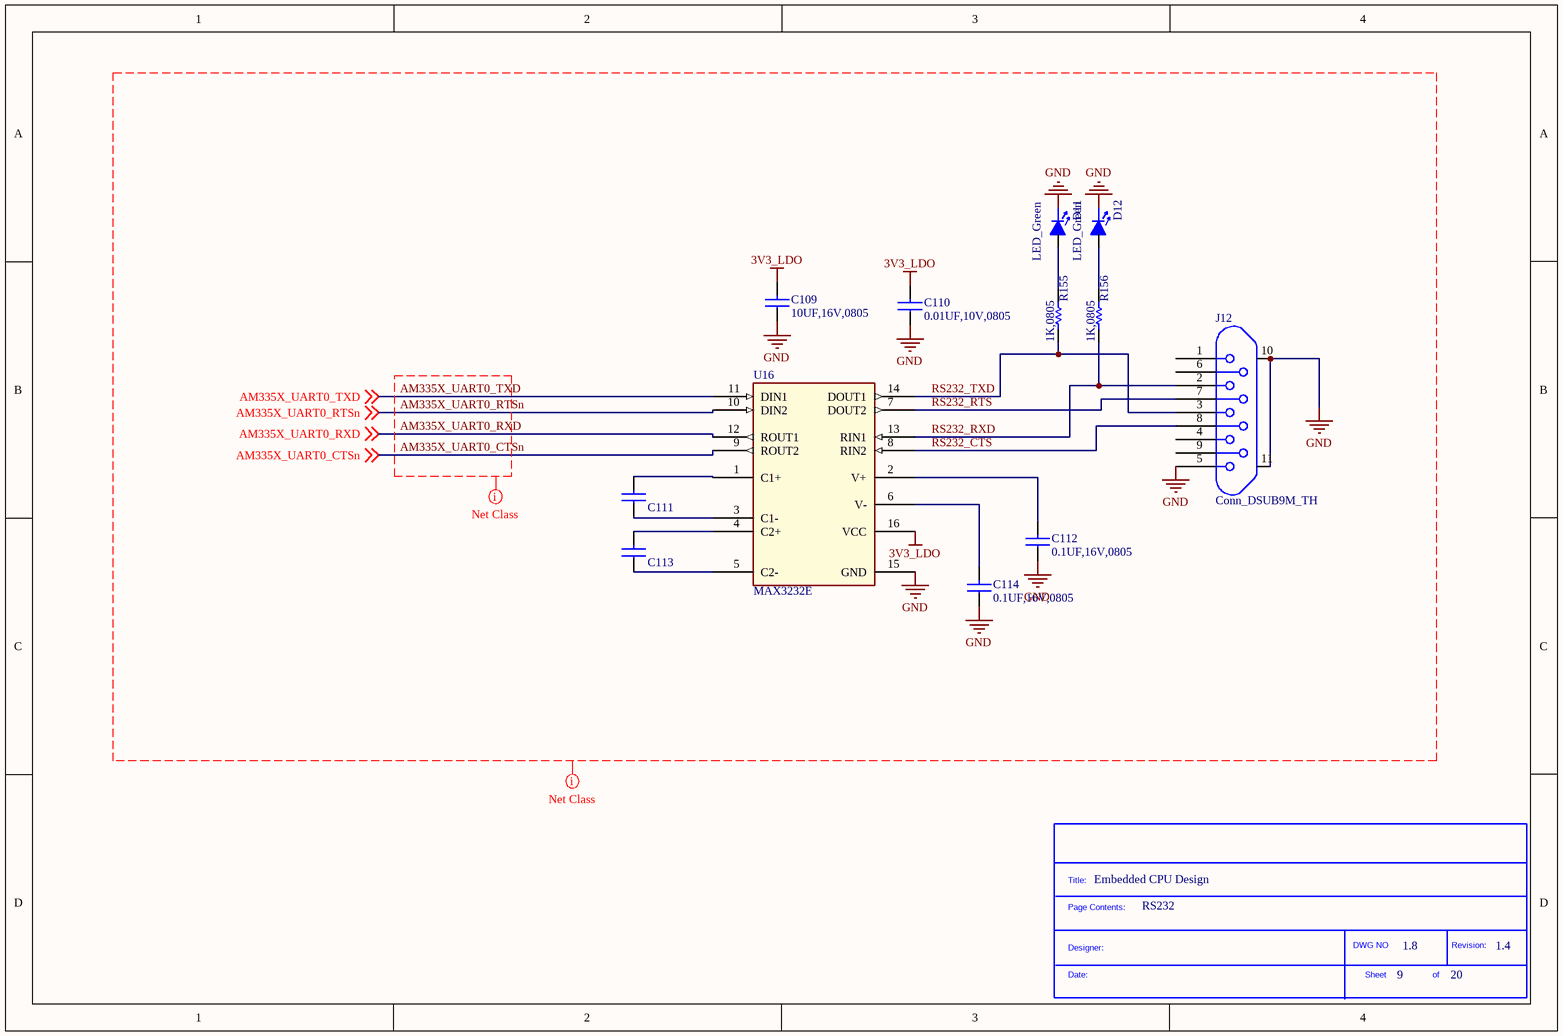
[diagram p19: RS232.SchDoc]

### Parts
(Parts that share a designator on the sheet are numbered #1, #2 ... from top to bottom, then left to right.)
*?#10  SDTitleBlock  (value not drawn)  (graphical)
C109  10UF,16V,0805  [0805]
C110  0.01UF,10V,0805  [0805]
C111  0.1UF,16V,0805  [0805]  (value not drawn)
C112  0.1UF,16V,0805  [0805]
C113  0.1UF,16V,0805  [0805]  (value not drawn)
C114  0.1UF,16V,0805  [0805]
D11  LED_Green  [LED_0805]
D12  LED_Green  [LED_0805]
J12  Conn_DSUB9M_TH  [norcomp_db9m_th]
R155  1K,0805  [0805]
R156  1K,0805  [0805]
U16  MAX3232E  [TI-DW16_M]

### Nets
3V3_LDO: C109.2 C110.2 U16.16(VCC)
GND: C109.1 C110.1 C112.1 C114.1 D11.1(Cathode) D12.1(Cathode) J12.5 J12.10 J12.11 U16.15(GND)
AM335X_UART0_CTSn: U16.9(ROUT2) ; off-sheet AM335X_UART0_CTSn
AM335X_UART0_RTSn: U16.10(DIN2) ; off-sheet AM335X_UART0_RTSn
AM335X_UART0_RXD: U16.12(ROUT1) ; off-sheet AM335X_UART0_RXD
AM335X_UART0_TXD: U16.11(DIN1) ; off-sheet AM335X_UART0_TXD
RS232_CTS: J12.8 U16.8(RIN2)
RS232_RTS: J12.7 U16.7(DOUT2)
RS232_RXD: J12.2 R156.1 U16.13(RIN1)
RS232_TXD: J12.3 R155.1 U16.14(DOUT1)
NetC111_1: C111.1 U16.3(C1-)
NetC111_2: C111.2 U16.1(C1+)
NetC112_2: C112.2 U16.2(V+)
NetC113_1: C113.1 U16.5(C2-)
NetC113_2: C113.2 U16.4(C2+)
NetC114_2: C114.2 U16.6(V-)
NetD11_2: D11.2(Anode) R155.2
NetD12_2: D12.2(Anode) R156.2

Not connected (* = marked no-connect by the designer): J12 1 4 6 9

### Layout directives
net class RS232: AM335X_UART0_CTSn, AM335X_UART0_RTSn, AM335X_UART0_RXD, AM335X_UART0_TXD
net class RS232_P: 3V3_LDO, AM335X_UART0_CTSn, AM335X_UART0_RTSn, AM335X_UART0_RXD, AM335X_UART0_TXD, GND, RS232_CTS, RS232_RTS, RS232_RXD, RS232_TXD

### Notes on the sheet
- Embedded CPU Design
- RS232
- 9
- 1.8
- 20
- 1.4
- (in symbol SDTitleBlock) Title:; Page Contents:; DWG NO; Revision:; Designer:; Date:; Sheet; of

### Library data of the parts
C109 = 10UF,16V,0805: AVX - 0805YD106KAT2A - CAP, MLCC, X5R, 10UF, 16V, 0805; Capacitance: 10; Capacitance Tolerance: ± 10%; Dielectric Characteristic: X5; Voltage Rating: 16; Ceramic Capacitor Case: 0805 [2012 Metric]; SVHC: No SVHC (16-Jun-2014); Capacitor Terminals: SMD; Tolerance: ±10%; Supplier 1: Digi-Key; Manufacturer: AVX; Manufacturer Part Number: 0805YD106KAT2A; RoHS: YES; Stock 1: 779135; Pricing 1: 1=0.25, 10=0.171, 25=0.1244, 100=0.0872, 500=0.06226, 1000=0.05291 (USD); Product Range: -; Operating Temperature Min: -55; Operating Temperature Max: 85; Packaging: Cut Tape; MSL: MSL 1 - Unlimited; Capacitance Tolerance ±: ± 10%; Capacitor Case Style: 0805 [2012 Metric]; Operating Temperature Range: -55°C to +85; Series: MLCC<!--FANDB--><div class="features-and-benefits-container"></div>; ComponentLink1URL: http://www.farnell.com/datasheets/1666675.pdf; ComponentLink1Description: http://www.farnell.com/datasheets/1666675.pdf; ComponentLink2URL: http://www.farnell.com/cad/1614404.zip; ComponentLink2Description: http://www.farnell.com/cad/1614404.zip; Supplier Part Number 1: 1276-1096-1-ND; Category: Capacitors; Voltage - Rated: 16V; Temperature Coefficient: X5R; Mounting Type: Surface Mount, MLCC; Operating Temperature: -55°C ~ 85°C; Applications: General Purpose; Ratings: -; Package / Case: 0805 (2012 Metric); Size / Dimension: 0.079" L x 0.049" W (2.00mm x 1.25mm); Height - Seated (Max): -; Thickness (Max): 0.055" (1.40mm); Lead Spacing: -; Features: -; Lead Style: -; ComponentLink3URL: http://www.samsungsem.com/kr/front/downloadcms.do?path=/kr/support/product-search/mlcc/__icsFiles/afieldfile/2014/11/05&fileName=S_CL21A106KOQNNNE.pdf; ComponentLink3Description: http://www.samsungsem.com/kr/front/downloadcms.do?path=/kr/support/product-search/mlcc/__icsFiles/afieldfile/2014/11/05&fileName=S_CL21A106KOQNNNE.pdf
C110 = 0.01UF,10V,0805: as C52 on sheet NAND_MEMORY; Supplier 1: Digi-Key; Manufacturer: MULTICOMP; Manufacturer Part Number: MCSH21B103K100CT; RoHS: YES; Stock 1: 21284; Pricing 1: 1=0.24, 10=0.2, 50=0.1126, 100=0.1, 250=0.075, 500=0.06626, 1000=0.05875 (USD); ComponentLink1URL: http://www.farnell.com/datasheets/1825494.pdf; ComponentLink1Description: http://www.farnell.com/datasheets/1825494.pdf; Supplier Part Number 1: 399-7995-1-ND; Category: Capacitors; Packaging: Cut Tape (CT); Temperature Coefficient: X7R; Mounting Type: Surface Mount, MLCC; Operating Temperature: -55°C ~ 125°C; Applications: General Purpose; Ratings: -; Package / Case: 0805 (2012 Metric); Size / Dimension: 0.079" L x 0.049" W (2.00mm x 1.25mm); Height - Seated (Max): -; Thickness (Max): 0.035" (0.88mm); Lead Spacing: -; Features: -; Lead Style: -; ComponentLink2URL: http://www.kemet.com/docfinder?Partnumber=C0805C103K4RACTU; ComponentLink2Description: http://www.kemet.com/docfinder?Partnumber=C0805C103K4RACTU
C111-C114 = 0.1UF,16V,0805: as C106 on sheet POWER_CON; Supplier 1: Digi-Key; Manufacturer: AVX; Manufacturer Part Number: 0805YC104KAT2A; RoHS: YES; Stock 1: 9101; Pricing 1: 1=0.29, 10=0.198, 100=0.1008, 250=0.0816, 500=0.072, 1000=0.0612 (USD); Product Range: -; Operating Temperature Min: -55; Operating Temperature Max: 125; Packaging: Cut Tape; MSL: MSL 1 - Unlimited; Capacitance Tolerance ±: ± 10%; ComponentLink1URL: http://www.farnell.com/datasheets/1679506.pdf; ComponentLink1Description: http://www.farnell.com/datasheets/1679506.pdf; Supplier Part Number 1: 478-7961-1-ND; Category: Capacitors; Voltage - Rated: 16V; Temperature Coefficient: X7R; Mounting Type: Surface Mount, MLCC; Operating Temperature: -55°C ~ 125°C; Applications: General Purpose; Ratings: -; Package / Case: 0805 (2012 Metric); Size / Dimension: 0.079" L x 0.049" W (2.00mm x 1.25mm); Height - Seated (Max): -; Thickness (Max): 0.037" (0.94mm); Lead Spacing: -; Features: -; Lead Style: -; ComponentLink2URL: http://www.avx.com/docs/Catalogs/cx7r.pdf; ComponentLink2Description: http://www.avx.com/docs/Catalogs/cx7r.pdf
D11 D12 = LED_Green: as D8 on sheet POWER_CON; DescriptiveText: LED Green SMD 20mA 2V 0805; Descriptive_Text: LED Green SMD 20mA 2V 0805; Supplier 1: Digi-Key; Manufacturer: Dialight; Manufacturer Part Number: 598-8170-107F; RoHS: RoHS Compliant; Category: Optoelectronics; Stock 1: 91030; Pricing 1: 1=0.42, 10=0.31, 25=0.248, 100=0.1643, 250=0.1364, 500=0.0992, 1000=0.0775 (USD); Packaging: Cut Tape (CT); Color: Green; Wavelength - Peak: -; Voltage - Forward (Vf) (Typ): 2V; Current - Test: 20mA; Package / Case: 0805 (2012 Metric); Size / Dimension: 2.00mm L x 1.25mm W; Height: 0.70mm; Mounting Type: Surface Mount; Luminous Flux @ Current - Test: -; ComponentLink1URL: http://media.digikey.com/pdf/Data%20Sheets/Dialight%20PDFs/598_Series_0805_Pkg.pdf; ComponentLink1Description: http://media.digikey.com/pdf/Data%20Sheets/Dialight%20PDFs/598_Series_0805_Pkg.pdf; Supplier Part Number 1: 350-2044-1-ND
J12 = Conn_DSUB9M_TH: TIIntPartnumber: 2C0098; MfrNum: 182-009-113R531; Mfr: Norcomp; PartName: Conn_DSub9MTH; Cost10K: 0.82; Cost100: 1.20; Vendor: Digikey; DescriptiveText: Connector DB9 Male RA Throughhole
R155 R156 = 1K,0805: BOURNS - CR0805-FX-1001ELF - RESISTOR, 1K, 0.125W, 1%; Product Range: BOURNS - CR Series; Resistance: 1; Power Rating: 125; Resistor Case Style: 0805 [2012 Metric]; Resistor Element Material: Thick Film; Temperature Coefficient: ± 100; Voltage Rating: 150; SVHC: No SVHC (16-Jun-2014); Resistor Mounting: SMD<!--FANDB--><div class="features-and-benefits-container"></div>; Power (Watts): 0.125W, 1/8W; Manufacturer: BOURNS; Manufacturer Part Number: CR0805-FX-1001ELF; RoHS: YES; Resistance Tolerance: ± 1%; Packaging: Cut Tape; MSL: MSL 1 - Unlimited; ComponentLink1URL: http://www.farnell.com/datasheets/1845293.pdf; ComponentLink1Description: http://www.farnell.com/datasheets/1845293.pdf; Supplier 1: Digi-Key; Category: Resistors; Stock 1: 2060902; Pricing 1: 1=0.1, 50=0.0288, 100=0.0219, 250=0.01624, 500=0.012, 1000=0.008, 2500=0.00675 (USD); Resistance (Ohms): 1k; Tolerance: ±1%; Composition: Thick Film; Features: Automotive AEC-Q200; Operating Temperature: -55°C ~ 155°C; Package / Case: 0805 (2012 Metric); Supplier Device Package: 0805; Size / Dimension: 0.079" L x 0.049" W (2.00mm x 1.25mm); Height: 0.028" (0.70mm); Number of Terminations: 2; ComponentLink2URL: http://industrial.panasonic.com/www-cgi/jvcr13pz.cgi?E+PZ+3+AOA0002+ERJ6ENF1001V+7+WW; ComponentLink2Description: http://industrial.panasonic.com/www-cgi/jvcr13pz.cgi?E+PZ+3+AOA0002+ERJ6ENF1001V+7+WW; Supplier Part Number 1: P1.00KCCT-ND
U16 = MAX3232E: Dual Channel RS-232 Line Driver/Receiver; TIIntPartnumber: 1A0213; MfrNum: MAX3232ECD; Mfr: TI; Manufacturer: Texas Instruments; Manufacturer Part Number: MAX3232CDWR; Cost10K: 0.81; Cost100: 1.47; Vendor: Digikey; Protocol: RS232; Number of Drivers/Receivers: 2/2; Duplex: Full; Receiver Hysteresis: 300mV; Data Rate: 250kbps; Voltage - Supply: 3 V ~ 5.5 V; DescriptiveText: Dual Channel RS-232 Line Driver/Receiver; PartName: MAX3232E; Descriptive_Text: Dual Channel RS-232 Line Driver/Receiver; Supplier 1: Digi-Key; Supplier Part Number 1: 296-13095-1-ND; RoHS: RoHS Compliant; Category: Integrated Circuits (ICs); Stock 1: 4145; Pricing 1: 1=1.91, 10=1.728, 25=1.548, 100=1.392, 250=1.236, 500=1.08, 750=0.978, 1000=0.894 (USD); Packaging: Cut Tape (CT); Type: Transceiver; Operating Temperature: 0°C ~ 70°C; Mounting Type: Surface Mount; Package / Case: 16-SOIC (0.295", 7.50mm Width); Supplier Device Package: 16-SOIC; ComponentLink1URL: http://www.ti.com/lit/ds/symlink/max3232.pdf; ComponentLink1Description: http://www.ti.com/lit/ds/symlink/max3232.pdf

## Sheet RS485.SchDoc
size A4
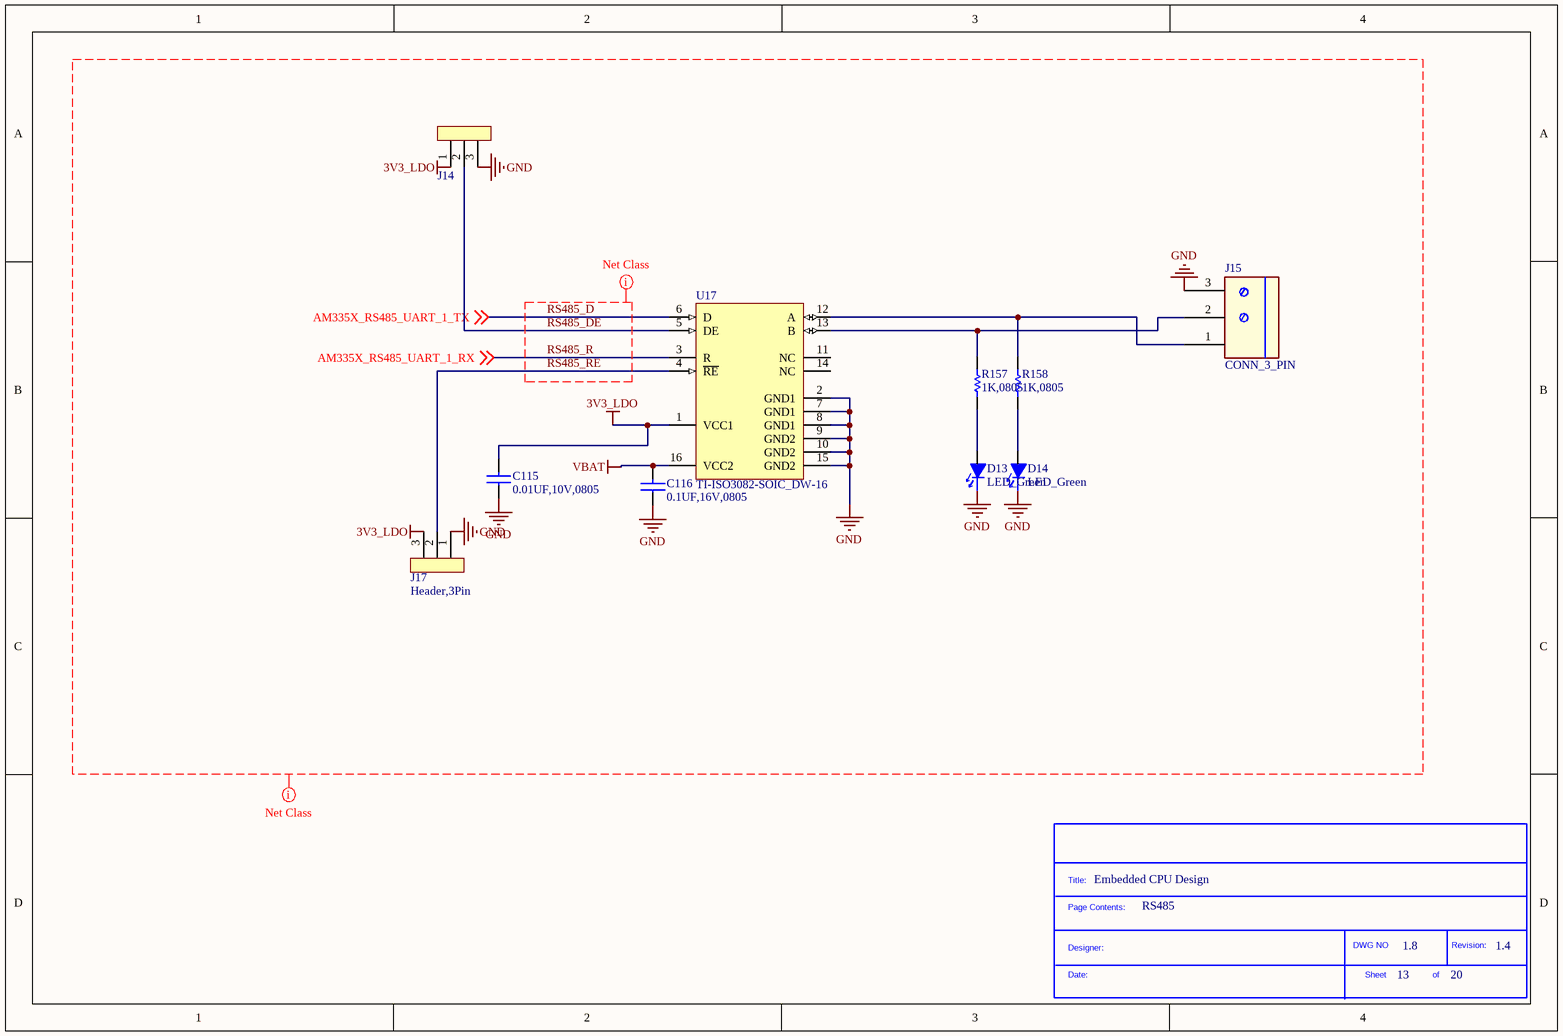
[diagram p20: RS485.SchDoc]

### Parts
(Parts that share a designator on the sheet are numbered #1, #2 ... from top to bottom, then left to right.)
*?#11  SDTitleBlock  (value not drawn)  (graphical)
C115  0.01UF,10V,0805  [0805]
C116  0.1UF,16V,0805  [0805]
D13  LED_Green  [LED_0805]
D14  LED_Green  [LED_0805]
J14  Header,3Pin  [SMD_JUMPER]  (value not drawn)
J15  CONN_3_PIN  [CON_3]
J17  Header,3Pin  [SMD_JUMPER]
R157  1K,0805  [0805]
R158  1K,0805  [0805]
U17  TI-ISO3082-SOIC_DW-16  [DW16_L]

### Nets
3V3_LDO: C115.2 J14.1 J17.3 U17.1(VCC1)
GND: C115.1 C116.1 D13.1(Cathode) D14.1(Cathode) J14.3 J15.3 J17.1 U17.2(GND1) U17.7(GND1) U17.8(GND1) U17.9(GND2) U17.10(GND2) U17.15(GND2)
VBAT: C116.2 U17.16(VCC2)
RS485_D: U17.6(D) ; off-sheet AM335X_RS485_UART_1_TX  [also labelled AM335X_RS485_UART_1_TX]
RS485_DE: J14.2 U17.5(DE)
RS485_R: U17.3(R) ; off-sheet AM335X_RS485_UART_1_RX  [also labelled AM335X_RS485_UART_1_RX]
RS485_RE: J17.2 U17.4(~{RE})
NetD13_2: D13.2(Anode) R157.2
NetD14_2: D14.2(Anode) R158.2
NetJ15_1: J15.1 R158.1 U17.12(A)
NetJ15_2: J15.2 R157.1 U17.13(B)

Not connected (* = marked no-connect by the designer): U17 11(NC) 14(NC)

### Layout directives
net class RS485: RS485_D, RS485_DE, RS485_R, RS485_RE
net class RS485_P: 3V3_LDO, AM335X_RS485_UART_1_RX, AM335X_RS485_UART_1_TX, GND, RS485_D, RS485_DE, RS485_R, RS485_RE, VBAT

### Notes on the sheet
- Embedded CPU Design
- RS485
- 13
- 1.8
- 20
- 1.4
- (in symbol SDTitleBlock) Title:; Page Contents:; DWG NO; Revision:; Designer:; Date:; Sheet; of

### Library data of the parts
C115 = 0.01UF,10V,0805: as C52 on sheet NAND_MEMORY; Supplier 1: Digi-Key; Manufacturer: MULTICOMP; Manufacturer Part Number: MCSH21B103K100CT; RoHS: YES; Stock 1: 21284; Pricing 1: 1=0.24, 10=0.2, 50=0.1126, 100=0.1, 250=0.075, 500=0.06626, 1000=0.05875 (USD); ComponentLink1URL: http://www.farnell.com/datasheets/1825494.pdf; ComponentLink1Description: http://www.farnell.com/datasheets/1825494.pdf; Supplier Part Number 1: 399-7995-1-ND; Category: Capacitors; Packaging: Cut Tape (CT); Temperature Coefficient: X7R; Mounting Type: Surface Mount, MLCC; Operating Temperature: -55°C ~ 125°C; Applications: General Purpose; Ratings: -; Package / Case: 0805 (2012 Metric); Size / Dimension: 0.079" L x 0.049" W (2.00mm x 1.25mm); Height - Seated (Max): -; Thickness (Max): 0.035" (0.88mm); Lead Spacing: -; Features: -; Lead Style: -; ComponentLink2URL: http://www.kemet.com/docfinder?Partnumber=C0805C103K4RACTU; ComponentLink2Description: http://www.kemet.com/docfinder?Partnumber=C0805C103K4RACTU
C116 = 0.1UF,16V,0805: as C106 on sheet POWER_CON; Supplier 1: Digi-Key; Manufacturer: AVX; Manufacturer Part Number: 0805YC104KAT2A; RoHS: YES; Stock 1: 9101; Pricing 1: 1=0.29, 10=0.198, 100=0.1008, 250=0.0816, 500=0.072, 1000=0.0612 (USD); Product Range: -; Operating Temperature Min: -55; Operating Temperature Max: 125; Packaging: Cut Tape; MSL: MSL 1 - Unlimited; Capacitance Tolerance ±: ± 10%; ComponentLink1URL: http://www.farnell.com/datasheets/1679506.pdf; ComponentLink1Description: http://www.farnell.com/datasheets/1679506.pdf; Supplier Part Number 1: 478-7961-1-ND; Category: Capacitors; Voltage - Rated: 16V; Temperature Coefficient: X7R; Mounting Type: Surface Mount, MLCC; Operating Temperature: -55°C ~ 125°C; Applications: General Purpose; Ratings: -; Package / Case: 0805 (2012 Metric); Size / Dimension: 0.079" L x 0.049" W (2.00mm x 1.25mm); Height - Seated (Max): -; Thickness (Max): 0.037" (0.94mm); Lead Spacing: -; Features: -; Lead Style: -; ComponentLink2URL: http://www.avx.com/docs/Catalogs/cx7r.pdf; ComponentLink2Description: http://www.avx.com/docs/Catalogs/cx7r.pdf
D13 D14 = LED_Green: as D8 on sheet POWER_CON; DescriptiveText: LED Green SMD 20mA 2V 0805; Descriptive_Text: LED Green SMD 20mA 2V 0805; Supplier 1: Digi-Key; Manufacturer: Dialight; Manufacturer Part Number: 598-8170-107F; RoHS: RoHS Compliant; Category: Optoelectronics; Stock 1: 91030; Pricing 1: 1=0.42, 10=0.31, 25=0.248, 100=0.1643, 250=0.1364, 500=0.0992, 1000=0.0775 (USD); Packaging: Cut Tape (CT); Color: Green; Wavelength - Peak: -; Voltage - Forward (Vf) (Typ): 2V; Current - Test: 20mA; Package / Case: 0805 (2012 Metric); Size / Dimension: 2.00mm L x 1.25mm W; Height: 0.70mm; Mounting Type: Surface Mount; Luminous Flux @ Current - Test: -; ComponentLink1URL: http://media.digikey.com/pdf/Data%20Sheets/Dialight%20PDFs/598_Series_0805_Pkg.pdf; ComponentLink1Description: http://media.digikey.com/pdf/Data%20Sheets/Dialight%20PDFs/598_Series_0805_Pkg.pdf; Supplier Part Number 1: 350-2044-1-ND
R157 R158 = 1K,0805: as R155 on sheet RS232; Manufacturer: BOURNS; Manufacturer Part Number: CR0805-FX-1001ELF; RoHS: YES; Resistance Tolerance: ± 1%; Packaging: Cut Tape; MSL: MSL 1 - Unlimited; ComponentLink1URL: http://www.farnell.com/datasheets/1845293.pdf; ComponentLink1Description: http://www.farnell.com/datasheets/1845293.pdf; Supplier 1: Digi-Key; Category: Resistors; Stock 1: 2060902; Pricing 1: 1=0.1, 50=0.0288, 100=0.0219, 250=0.01624, 500=0.012, 1000=0.008, 2500=0.00675 (USD); Resistance (Ohms): 1k; Tolerance: ±1%; Composition: Thick Film; Features: Automotive AEC-Q200; Operating Temperature: -55°C ~ 155°C; Package / Case: 0805 (2012 Metric); Supplier Device Package: 0805; Size / Dimension: 0.079" L x 0.049" W (2.00mm x 1.25mm); Height: 0.028" (0.70mm); Number of Terminations: 2; ComponentLink2URL: http://industrial.panasonic.com/www-cgi/jvcr13pz.cgi?E+PZ+3+AOA0002+ERJ6ENF1001V+7+WW; ComponentLink2Description: http://industrial.panasonic.com/www-cgi/jvcr13pz.cgi?E+PZ+3+AOA0002+ERJ6ENF1001V+7+WW; Supplier Part Number 1: P1.00KCCT-ND
U17 = TI-ISO3082-SOIC_DW-16: Manufacturer: Texas Instruments; Manufacturer Part Number: ISO3082DWR; Isolated Power: Yes; Number of Channels: 3; Inputs - Side 1/Side 2: 2/1; Channel Type: Unidirectional; Voltage - Isolation: 4000Vpk; Common Mode Transient Immunity (Min): 25kV/µs; Data Rate: 200Kbps; Pulse Width Distortion (Max): 200ns, 200ns; Voltage - Supply: 3.15 V ~ 5.5 V, 4.5 V ~ 5.5 V; Supplier 1: Digi-Key; Supplier Part Number 1: 296-37891-1-ND; RoHS: RoHS Compliant; Category: Isolators; Stock 1: 487; Pricing 1: 1=6.74, 10=6.037, 25=5.4288, 100=4.9374, 250=4.4694, 500=4.0014, 750=3.627, 1000=3.3696 (USD); Packaging: Cut Tape (CT); Technology: Capacitive Coupling; Type: RS422, RS485; Propagation Delay tpLH / tpHL (Max): -; Rise / Fall Time (Typ): -; Operating Temperature: -40°C ~ 85°C; Package / Case: 16-SOIC (0.295", 7.50mm Width); Supplier Device Package: 16-SOIC; ComponentLink1URL: http://www.ti.com/lit/ds/symlink/iso3082.pdf; ComponentLink1Description: http://www.ti.com/lit/ds/symlink/iso3082.pdf